# EAGLE design HM-ES-TX-WM_IEC_v1p0 (EAGLE 8.7.1)
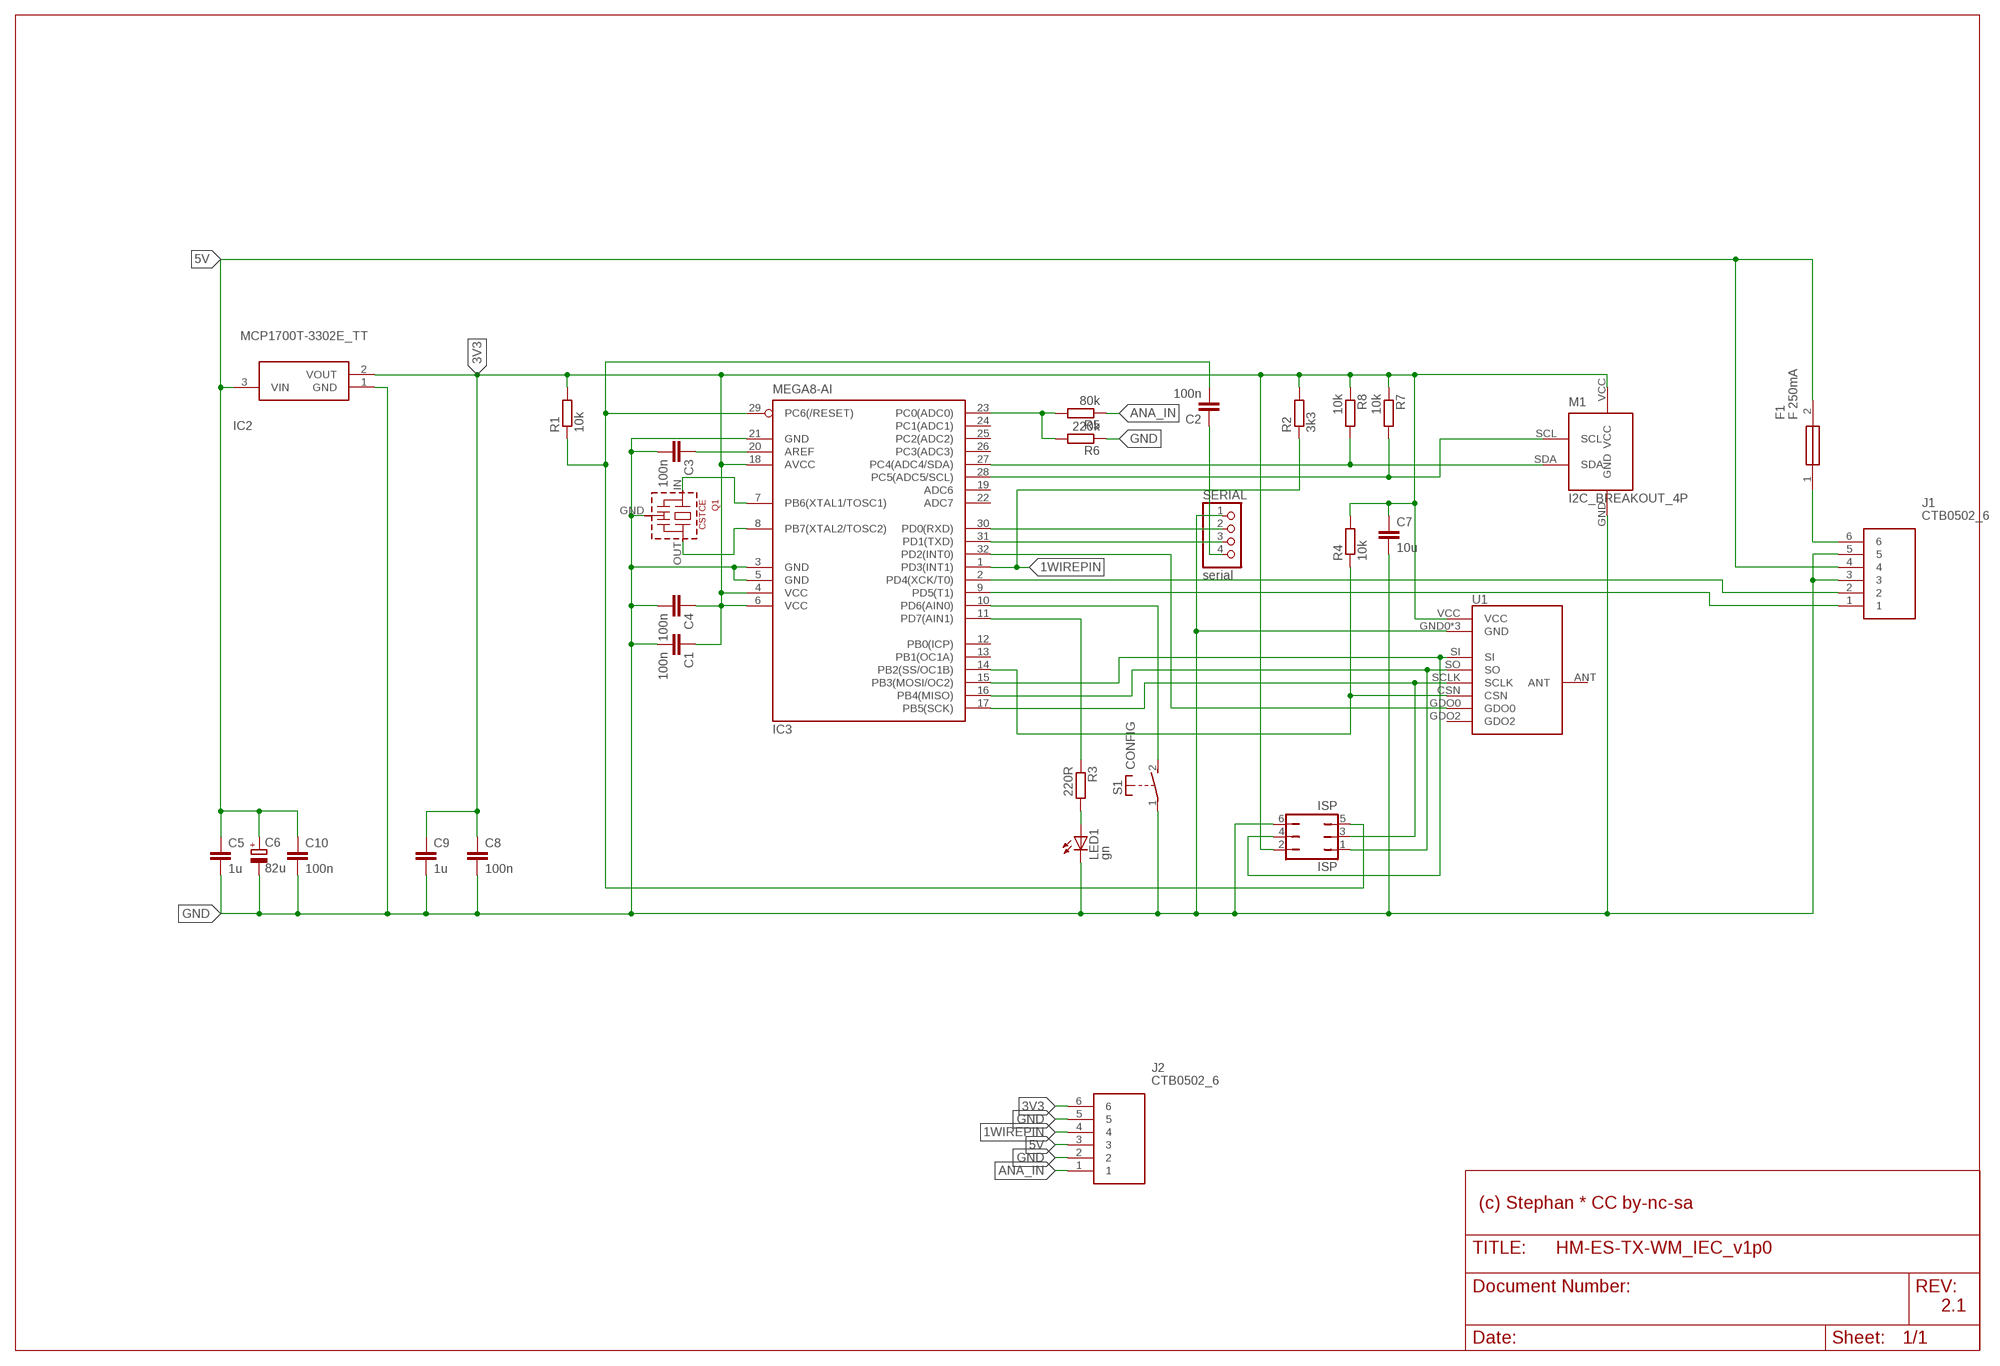
[diagram p0: schematic, sheet 1]

## Parts
C1  100n  C-EUC0805K  [C0805K]
C2  100n  C-EUC0805K  [C0805K]
C3  100n  C-EUC0805K  [C0805K]
C4  100n  C-EUC0805K  [C0805K]
C5  1u  C-EUC0805K  [C0805K]
C6  82u  CPOL-EUSANYO_SMD_C6  [SANYO-OSCON_SMD_C6]
C7  10u  C-EUC0805K  [C0805K]
C8  100n  C-EUC0805K  [C0805K]
C9  1u  C-EUC0805K  [C0805K]
C10  100n  C-EUC0805K  [C0805K]
F1  F 250mA  0679H1000-05  [FUSC6125X279N]
IC2  MCP1700T-3302E_TT  MCP1700T-5002E_TT  [SOT95P237X112-3N]
IC3  MEGA8-AI  [TQFP32-08]
ISP  ISP  JP3Q  [JP3Q]
J1  CTB0502_6  [CTB05026]
J2  CTB0502_6  [CTB05026]
LED1  gn  LEDCHIPLED_0805  [CHIPLED_0805]
M1  I2C_BREAKOUT_4P  [I2C_BREAKOUT_4P]
Q1  CSTCE  [CSTCE]
R1  10k  R-EU_R0805W  [R0805W]
R2  3k3  R-EU_R0805W  [R0805W]
R3  220R  R-EU_R0805W  [R0805W]
R4  10k  R-EU_R0805W  [R0805W]
R5  80k  R-EU_R0805W  [R0805W]
R6  220k  R-EU_R0805W  [R0805W]
R7  10k  R-EU_R0805W  [R0805W]
R8  10k  R-EU_R0805W  [R0805W]
S1  CONFIG  SMDSWITCH6X4  [SMDSWITCH6X4]
SERIAL  serial  PINHD-1X4  [1X04]
U1  CC1101SMD  [CC1101-SMD]

## Nets
1WIREPIN: IC3.1(PD3(INT1)) J2.4 R2.1
3V3: C1.1 C4.1 C7.1 C8.1 C9.1 IC2.2(VOUT) IC3.4(VCC) IC3.6(VCC) IC3.18(AVCC) ISP.2 J2.6 M1.VCC R1.2 R2.2 R4.2 R7.1 R8.1 U1.VCC
5V: C5.1 C6.+ C10.1 F1.2 IC2.3(VIN) J1.4 J2.3
ANA_IN: J2.1 R5.1
ANA_IN_PIN: IC3.23(PC0(ADC0)) R5.2 R6.2
AREF: C3.1 IC3.20(AREF)
BTNPIN: IC3.10(PD6(AIN0)) S1.2(S)
CSN: IC3.14(PB2(SS/OC1B)) R4.1 U1.CSN
D4: IC3.2(PD4(XCK/T0)) J1.2
D5: IC3.9(PD5(T1)) J1.1
DTR: C2.1 SERIAL.4
GDO0: IC3.32(PD2(INT0)) U1.GDO0
GND: C1.2 C3.2 C4.2 C5.2 C6.- C7.2 C8.2 C9.2 C10.2 IC2.1(GND) IC3.3(GND) IC3.5(GND) IC3.21(GND) ISP.6 J1.3 J1.5 J2.2 J2.5 LED1.C M1.GND Q1.GND R6.1 S1.1(P) SERIAL.1 U1.GND0(GND) U1.GND1(GND) U1.GND2(GND)
LED1: LED1.A R3.2
LEDPIN: IC3.11(PD7(AIN1)) R3.1
MISO: IC3.16(PB4(MISO)) ISP.1 U1.SO
MOSI: IC3.15(PB3(MOSI/OC2)) ISP.4 U1.SI
RESET: C2.2 IC3.29(PC6(/RESET)) ISP.5 R1.1
RXD: IC3.30(PD0(RXD)) SERIAL.2
SCL: IC3.28(PC5(ADC5/SCL)) M1.SCL R7.2
SCLK: IC3.17(PB5(SCK)) ISP.3 U1.SCLK
SDA: IC3.27(PC4(ADC4/SDA)) M1.SDA R8.2
TXD: IC3.31(PD1(TXD)) SERIAL.3
VIN: F1.1 J1.6
XTAL1: IC3.7(PB6(XTAL1/TOSC1)) Q1.IN
XTAL2: IC3.8(PB7(XTAL2/TOSC2)) Q1.OUT
Unconnected: IC3.12(PB0(ICP)) IC3.13(PB1(OC1A)) IC3.19(ADC6) IC3.22(ADC7) IC3.24(PC1(ADC1)) IC3.25(PC2(ADC2)) IC3.26(PC3(ADC3)) U1.ANT U1.GDO2

## Notes on the sheet
- (c) Stephan * CC by-nc-sa
- 2.1

## Library data of the parts
C1-C5 C7-C10 = resistor:C-EU: CAPACITOR, European symbol
C6 = rcl:CPOL-EU: POLARIZED CAPACITOR, European symbol; SPICEPREFIX: C
F1 = SamacSys_Parts:0679H1000-05: Fuse Chip Fast Acting 1A 350V Solder Pad SMD 2410 Ceramic T/R Source: Datasheet <https://www.arrow.com/en/products/0679h1000-05/bel-group>; ARROW_PART_NUMBER: 0679H1000-05; ARROW_PRICE-STOCK: https://www.arrow.com/en/products/0679h1000-05/bel-group?region=nac; DESCRIPTION: Fuse Chip Fast Acting 1A 350V Solder Pad SMD 2410 Ceramic T/R; HEIGHT: 2.79mm; MANUFACTURER_NAME: Bel Circuit Protection; MANUFACTURER_PART_NUMBER: 0679H1000-05
IC2 = SamacSys_Parts:MCP1700T-5002E_TT: LDO Regulator 250mA 5.0V 1.6uA SOT23 Source: Datasheet <https://datasheet.datasheetarchive.com/originals/distributors/SFDatasheet-4/sf-00090030.pdf>; ARROW_PART_NUMBER: MCP1700T-5002E/TT; ARROW_PRICE-STOCK: https://www.arrow.com/en/products/mcp1700t-5002ett/microchip-technology?region=nac; DESCRIPTION: LDO Regulator 250mA 5.0V 1.6uA SOT23; HEIGHT: 1.12mm; MANUFACTURER_NAME: Microchip; MANUFACTURER_PART_NUMBER: MCP1700T-5002E/TT; MOUSER_PART_NUMBER: 579-MCP1700T5002E/TT; MOUSER_PRICE-STOCK: https://www.mouser.co.uk/ProductDetail/Microchip-Technology-Atmel/MCP1700T-5002E-TT?qs=fM4xO01eazNr4AnStMRB%2Fg%3D%3D
IC3 = atmel:MEGA8: MICROCONTROLLER 8 Kbytes FLASH, 1 kbytes SRAM, 512 bytes EEPROM, USART, 6-channel 10 bit ADC, 2-channel 8 bit ADC Pin compatible with Atmega48, ATMega88, ATMega168 Source: avr.lbr; MPN: ATMEGA8-16AU; OC_FARNELL: 9171371; OC_NEWARK: 73M8863
ISP = jumper:JP3Q: JUMPER
J1 J2 = SamacSys_Parts:CTB0502_6: RS PRO, 6 Way PCB Terminal Block Source: Datasheet <https://www.camdenboss.com/products/datasheet/CTB0502_series_D.pdf>; DESCRIPTION: RS PRO, 6 Way PCB Terminal Block; HEIGHT: 10mm; MANUFACTURER_NAME: RS Components; MANUFACTURER_PART_NUMBER: CTB0502/6
LED1 = led:LED: LED OSRAM: - CHIPLED LG R971, LG N971, LY N971, LG Q971, LY Q971, LO R971, LY R971 LH N974, LH R974 LS Q976, LO Q976, LY Q976 LO Q996 - Hyper CHIPLED LW Q18S LB Q993, LB Q99A, LB R99A - SideLED LS A670, LO A670, LY A670, LG A670, LP A670 LB A673, LV A673, LT A673, LW A673 LH A674 LY A675 LS A676, LA A676, LO A676, LY A676, LW A676 LS A679, LY A679, LG A679 - Hyper Micro SIDELED® LS Y876, LA Y876, LO Y876, LY Y876 LT Y87S - SmartLED LW L88C, LW L88S LB L89C, LB L89S, LG L890 LS L89K, LO L89K, LY L89K LS L896, LA L896, LO L896, LY L896 - TOPLED LS T670, LO T670, LY T670, LG T670, LP T670 LSG T670, LSP T670, LSY T670, LOP T670, LYG T670 LG T671, LOG T671, LSG T671 LB T673, LV T673, LT T673, LW T673 LH T674 LS T676, LA T676, LO T676, LY T676, LB T676, LH T676, LSB T676, LW T676 LB T67C, LV T67C, LT T67C, LS T67K, LO T67K, LY T67K, LW E67C LS E67B, LA E67B, LO E67B, LY E67B, LB E67C, LV E67C, LT E67C LW T67C LS T679, LY T679, LG T679 LS T770, LO T770, LY T770, LG T770, LP T770 LB T773, LV T773, LT T773, LW T773 LH T774 LS E675, LA E675, LY E675, LS T675 LS T776, LA T776, LO T776, LY T776, LB T776 LHGB T686 LT T68C, LB T68C - Hyper Mini TOPLED® LB M676 - Mini TOPLED Santana® LG M470 LS M47K, LO M47K, LY M47K Source: http://www.osram.convergy.de LUXEON: - LUMILED® LXK2-PW12-R00, LXK2-PW12-S00, LXK2-PW14-U00, LXK2-PW14-V00 LXK2-PM12-R00, LXK2-PM12-S00, LXK2-PM14-U00 LXK2-PE12-Q00, LXK2-PE12-R00, LXK2-PE12-S00, LXK2-PE14-T00, LXK2-PE14-U00 LXK2-PB12-K00, LXK2-PB12-L00, LXK2-PB12-M00, LXK2-PB14-N00, LXK2-PB14-P00, LXK2-PB14-Q00 LXK2-PR12-L00, LXK2-PR12-M00, LXK2-PR14-Q00, LXK2-PR14-R00 LXK2-PD12-Q00, LXK2-PD12-R00, LXK2-PD12-S00 LXK2-PH12-R00, LXK2-PH12-S00 LXK2-PL12-P00, LXK2-PL12-Q00, LXK2-PL12-R00 Source: www.luxeon.com KINGBRIGHT: KA-3528ASYC Source: www.kingbright.com
M1 = StephansLib:I2C_BREAKOUT_4P: I2C breakout board 4pin, e.g. GY-49
Q1 = murata-cstcc-cstce-cstcr-cstcv-resonators:CSTCE: Murata CSTCE Resonator - 3,2 x 1,3 mm
R1-R8 = resistor:R-EU_: RESISTOR, European symbol
S1 = StephansLib:SMDSWITCH6X4: SMD button 6x4 mm
SERIAL = pinhead:PINHD-1X4: PIN HEADER
U1 = modules:CC1101

## Board
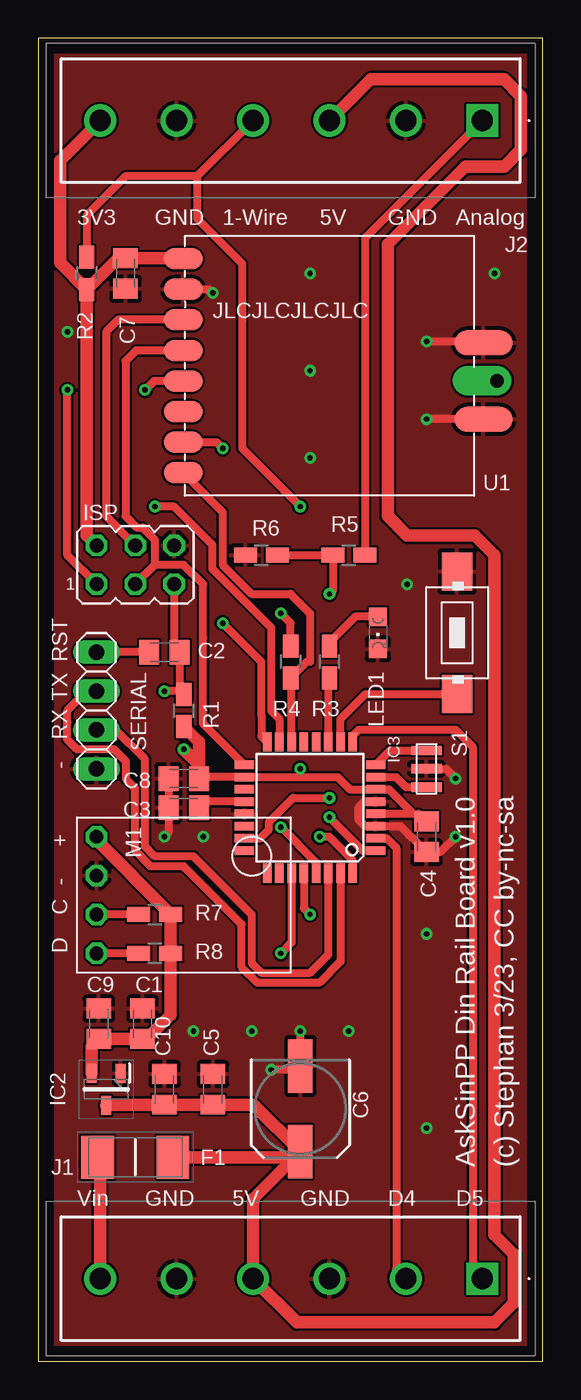
[diagram p1: board, top side]
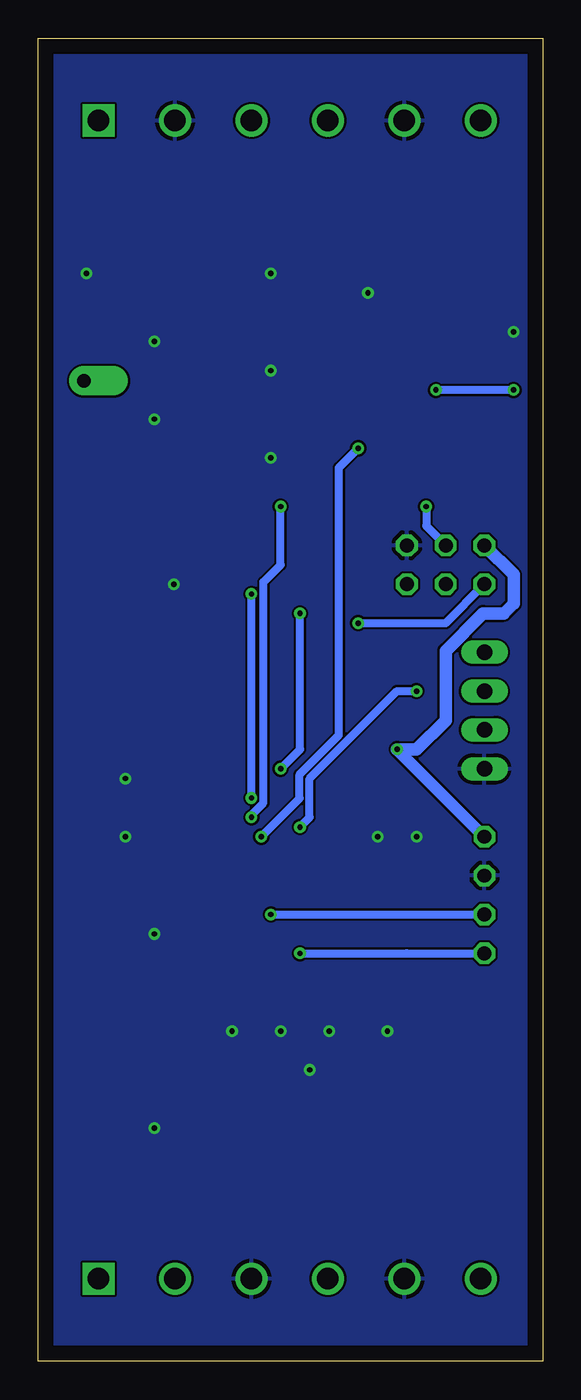
[diagram p2: board, bottom side, seen from below]

Size 33 x 86.5 mm. Coordinates in mm from the lower left corner, seen from the top.
Outline: 0,0 33,0 33,86.5 0,86.5 0,0
Copper layers (1*16): Top 0.035mm / dielectric 1.5mm / Bottom 0.035mm
Design rules "default": minimum track width 6mil, minimum drill 0.35mm, track to track 6mil, track to pad 6mil, pad to pad 6mil, via to via 6mil, smd to smd 6mil, copper to edge 40mil, drill to drill 6mil, minimum pad ring 10mil, minimum via ring 8mil, stop-mask expansion 4mil, vias tented up to drill 0mil, thermal gap 10mil

### Footprints (pad centres in the part's own frame; a part is rotated, then mirrored left to right if it is on the bottom)
C0805K = smd 1.3 x 1.6: 1 -1,0; 2 1,0
SANYO-OSCON_SMD_C6 = smd 3.5 x 1.6: + 2.8,0; - -2.8,0
FUSC6125X279N = smd 2.15 x 2.8: 1 -2.455,0; 2 2.455,0
SOT95P237X112-3N = smd 1.25 x 0.65: 1 -1.05,0.95; 2 -1.05,-0.95; 3 1.05,0
TQFP32-08 = smd 1.27 x 0.559: 1 -4.293,2.8; 2 -4.293,2; 3 -4.293,1.2; 4 -4.293,0.4; 5 -4.293,-0.4; 6 -4.293,-1.2; 7 -4.293,-2; 8 -4.293,-2.8; 17 4.293,-2.8; 18 4.293,-2; 19 4.293,-1.2; 20 4.293,-0.4; 21 4.293,0.4; 22 4.293,1.2; 23 4.293,2; 24 4.293,2.8 | smd 0.559 x 1.27: 9 -2.8,-4.293; 10 -2,-4.293; 11 -1.2,-4.293; 12 -0.4,-4.293; 13 0.4,-4.293; 14 1.2,-4.293; 15 2,-4.293; 16 2.8,-4.293; 25 2.8,4.293; 26 2,4.293; 27 1.2,4.293; 28 0.4,4.293; 29 -0.4,4.293; 30 -1.2,4.293; 31 -2,4.293; 32 -2.8,4.293
JP3Q = drill 0.914 octagon: 1 -2.54,-1.27; 2 -2.54,1.27; 3 0,-1.27; 4 0,1.27; 5 2.54,-1.27; 6 2.54,1.27
CTB05026 = drill 1.4 pad 2.1 square: 1 0,0 | drill 1.4 pad 2.1: 2 0,5; 3 0,10; 4 0,15; 5 0,20; 6 0,25
CHIPLED_0805 = smd 1.2 x 1.2: A 0,-1.05; C 0,1.05
I2C_BREAKOUT_4P = drill 0.9 octagon: GND -1.27,-2.54; SCL 1.27,-2.54; SDA 3.81,-2.54; VCC -3.81,-2.54
CSTCE = smd 0.6 x 2: GND 0,0; IN 1.2,0; OUT -1.2,0
R0805W = smd 1.5 x 1: 1 -1.052,0; 2 1.052,0
SMDSWITCH6X4 = smd 2.5 x 2: 1 -4,2; 2 4,2
1X04 = drill 1.016 long: 1 -3.81,0; 2 -1.27,0; 3 1.27,0; 4 3.81,0
CC1101-SMD = drill 0.9 pad 1.93 offset: ANT 10.965,-0.984 | smd 2.54 x 1.4: CSN -9.565,-7; GDO0 -9.565,-5; GDO2 -9.565,-3; GND0 -9.565,5; SCLK -9.565,1; SI -9.565,3; SO -9.565,-1; VCC -9.565,7 | smd 3.81 x 1.65: GND1 10.075,-3.5; GND2 10.075,1.5

### Placement (x,y rotation side)
C1  6.83,22.07 90 top
C2  8.26,46.35 0 top
C3  9.53,36.2 180 top
C4  25.4,34.29 270 top
C5  11.43,17.78 90 top
C6  17.14,16.51 270 top
C7  5.71,71.12 270 top
C8  9.53,38.1 180 top
C9  3.97,22.07 90 top
C10  8.26,17.78 90 top
F1  6.35,13.34 0 top
IC2  4.45,17.78 270 top
IC3  17.78,36.2 180 top
ISP  6.35,52.07 0 top
J1  29.05,5.4 90 top
J2  29.05,81.12 90 top
LED1  22.23,47.62 180 top
M1  6.35,30.48 270 top
Q1  25.4,38.73 270 top
R1  9.53,42.55 270 top
R2  3.17,71.12 270 top
R3  19.05,45.72 90 top
R4  16.51,45.72 90 top
R5  20.32,52.7 180 top
R6  14.61,52.7 0 top
R7  7.62,29.21 180 top
R8  7.62,26.67 180 top
S1  25.4,47.62 270 top
SERIAL  3.81,42.55 90 top
U1  19.05,65.09 0 top

### Tracks (layer width: path | path; a pad name or v marks a point on that pad's centre or on a via)
1WIREPIN  (via drill 0.35)
  Top 0.508: J2.4 10.4,77.47 | 10.4,77.47 5.71,77.47 3.17,74.93 R2.1 | IC3.1 21.21,33.4 v19.05,35.56 | 10.4,77.47 10.4,74.69 13.34,71.75 13.34,59.69 v17.14,55.88
  Bottom 0.508: v19.05,35.56 19.05,35.72 18.27,36.51 18.27,50.95 17.14,52.07 v17.14,55.88
3V3  (via drill 0.35)
  Top 0.508: 10.62,38.2 IC3.18 17.14,38.2 | C4.1 24.89,35.8 24.53,35.8 | 24.53,35.8 IC3.4 | 24.53,35.8 22.93,37.4 IC3.6 20.39,37.4 19.59,38.2 17.14,38.2 | 16.29,46.77 R4.2 16.51,48.26 v15.88,48.9 | 17.14,38.2 v17.14,38.73
  Top 0.61: 9.45,72.12 U1.VCC | 5.23,72.12 C7.1 | 10.62,38.2 C8.1
  Top 0.813: C7.1 9.45,72.12 | R2.2 5.23,72.12 | R1.2 10.53,40.49 C8.1 10.53,39.01 v9.53,40.01 | ISP.2 3.17,53.98 R2.2 | R2.2 1.42,71.82 1.42,78.49 J2.6 | IC2.2 3.5,20.59 C9.1 C1.1 7.1,21.07 8.67,22.64 R8.1 R7.1 3.81,34.07 M1.VCC
  Bottom 0.508: v17.14,38.73 15.88,40.01 v15.88,48.9
  Bottom 0.813: M1.VCC v9.53,40.01 8.26,40.01 6.35,41.91 6.35,46.45 3.9,48.9 2.54,48.9 1.91,49.53 1.91,51.44 ISP.2
5V
  Top 0.813: F1.2 16.77,13.34 14.05,10.62 J1.4 16.91,2.54 29.84,2.54 31.11,3.81 31.11,6.99 29.84,8.26 29.84,52.7 28.57,53.98 24.13,53.98 22.86,55.24 22.86,73.03 27.94,78.11 30.48,78.11 31.58,79.2 31.58,82.72 30.48,83.82 21.75,83.82 J2.3 | C6.+ 14.07,16.78 C5.1 C10.1 4.5,16.78 IC2.3
  Top 1.27: 16.77,13.34 C6.+
ANA_IN
  Top 0.508: R5.1 21.37,73.44 J2.1
ANA_IN_PIN  (via drill 0.35)
  Top 0.508: R6.2 R5.2 19.27,50.38 v19.05,50.16 | IC3.23 14.51,34.2 15.09,34.77 15.09,35.25 16.67,36.83 v19.05,36.83
  Bottom 0.508: v19.05,36.83 v19.05,50.16
AREF
  Top 0.508: IC3.20 10.93,36.59
  Top 0.61: 10.93,36.59 C3.1
BTNPIN
  Top 0.508: IC3.10 19.78,42.01 21.4,43.62 S1.2
CSN
  Top 0.508: U1.CSN 12.06,55.51 12.06,52.07 13.97,50.16 16.51,50.16 17.78,48.9 17.78,45.72 17.56,45.72 R4.1 16.58,44.6 IC3.14
D4
  Top 0.508: IC3.2 22.8,34.2 23.42,33.58 23.42,6.04 J1.2
D5
  Top 0.508: IC3.9 20.58,40.9 20.95,41.27 27.3,41.27 28.42,40.16 28.42,6.04 J1.1
DTR
  Top 0.508: C2.1 SERIAL.4
GDO0  (via drill 0.35)
  Top 0.508: IC3.32 20.58,32.76 19.05,34.29 v18.41,34.29 | U1.GDO0 11.67,60.09 v12.06,59.69
  Bottom 0.508: v18.41,34.29 15.9,36.8 15.9,38.37 13.34,40.94 13.34,58.42 v12.06,59.69
GND  (via drill 0.35)
  Top 0.508: Q1.GND 26.67,38.73 v27.3,38.1 | v27.3,34.29 26.3,33.29 C4.2 24.46,34.23 24.43,34.23 24.19,34.47 24.19,34.5 23.7,34.99 IC3.3 21.38,34.99 20.95,35.42 20.95,36.2 21.36,36.59 IC3.5 | C8.2 C3.2 8.53,34.56 v8.26,34.29 | U1.GND2 29.04,66.67 v25.4,66.67 | U1.GND1 v25.41,61.59 v25.4,61.59 | U1.GND0 11.19,70.09 v11.43,69.85 | v17.14,21.59 C6.- 16.89,19.05 v15.24,19.05
  other vias: 10.79,34.29 25.4,27.94 20.32,21.59 13.97,21.59 10.16,21.59 17.78,59.05 17.78,64.77 17.78,71.12 25.4,15.24 1.91,67.31 24.13,50.8 29.84,71.12
  pour Top: 0,86.36 33.02,86.36 33.02,0 0,0
  pour Bottom: 0,87 34.29,87 34.29,-0.64 0,-0.64 -0.64,-0.64 -0.64,87
LED1
  Top 0.508: LED1.A 20.73,48.67 19.05,46.99 R3.2
LEDPIN
  Top 0.508: IC3.11 18.98,44.6 R3.1
MISO  (via drill 0.35)
  Top 0.508: U1.SO 7.57,64.09 v6.99,63.5 | ISP.1 1.91,52.7 v1.91,63.5 | v12.06,48.26 14.58,45.74 14.58,42.27 14.61,42.25 14.61,40.86 IC3.16
  Bottom 0.508: v1.91,63.5 v6.99,63.5 | v12.06,48.26 6.35,48.26 ISP.1
MOSI  (via drill 0.35)
  Top 0.508: U1.SI 5.22,68.09 4.45,67.31 4.45,55.24 ISP.4 | IC3.15 15.78,42.01 15.24,42.55 15.24,47.96 13.36,49.84 13.19,50.02 11.4,51.8 11.4,53.37 8.89,55.88 v7.62,55.88
  Bottom 0.508: v7.62,55.88 7.62,54.61 ISP.4
RESET  (via drill 0.35)
  Top 0.508: ISP.5 8.89,46.72 C2.2 9.26,43.87 R1.1 9.31,43.81 v8.26,43.81 | IC3.29 18.18,32.62 v15.88,34.92
  Bottom 0.508: v15.88,34.92 15.24,35.56 15.24,38.1 9.53,43.81 v8.26,43.81
RXD
  Top 0.508: SERIAL.2 5.08,41.27 6.99,39.37 6.99,33.66 7.62,33.02 10.16,33.02 13.97,29.21 13.97,26.04 14.61,25.4 17.78,25.4 18.98,26.6 IC3.30
SCL  (via drill 0.35)
  Top 0.508: R7.2 M1.SCL | IC3.28 17.38,29.61 v17.78,29.21
  Bottom 0.508: v17.78,29.21 8.89,29.21 M1.SCL
SCLK
  Top 0.508: U1.SCLK 6.4,66.09 5.71,65.41 5.71,55.24 6.45,54.51 6.83,54.51 7.62,53.72 7.62,52.07 | 7.62,52.07 ISP.3 | IC3.17 10.77,41.71 10.77,47.26 10.79,47.29 10.79,50.8 9.53,52.07 7.62,52.07
SDA  (via drill 0.35)
  Top 0.508: R8.2 M1.SDA | IC3.27 16.58,27.38 v15.88,26.67
  Bottom 0.508: v15.88,26.67 8.89,26.67 M1.SDA
TXD
  Top 0.508: IC3.31 19.78,26.13 18.39,24.74 14.33,24.74 13.31,25.76 13.31,28.57 9.53,32.36 7.35,32.36 6.33,33.38 6.33,37.47 5.74,38.05 5.74,39.22 4.95,40.01 2.54,40.01 1.88,40.66 1.88,41.76 1.91,41.78 1.91,42.55 3.17,43.81 SERIAL.3
VIN
  Top 0.813: J1.6 4.05,12.22 3.42,12.86
  Top 1.27: 3.42,12.86 F1.1
XTAL1
  Top 0.508: IC3.7 23.4,38.2 24.06,37.53 Q1.IN
XTAL2
  Top 0.508: IC3.8 23.01,39.94 Q1.OUT

### Text on the board
tNames: 3V3 | GND | 1-Wire | 5V | GND | Analog | JLCJLCJLCJLC | RST | TX | RX | - | + | - | C | D | AskSinPP Din Rail Board v1.0 | (c) Stephan 3/23, CC by-nc-sa | Vin | GND | 5V | GND | D4 | D5